# EAGLE design keyboard (EAGLE 8.5.2)
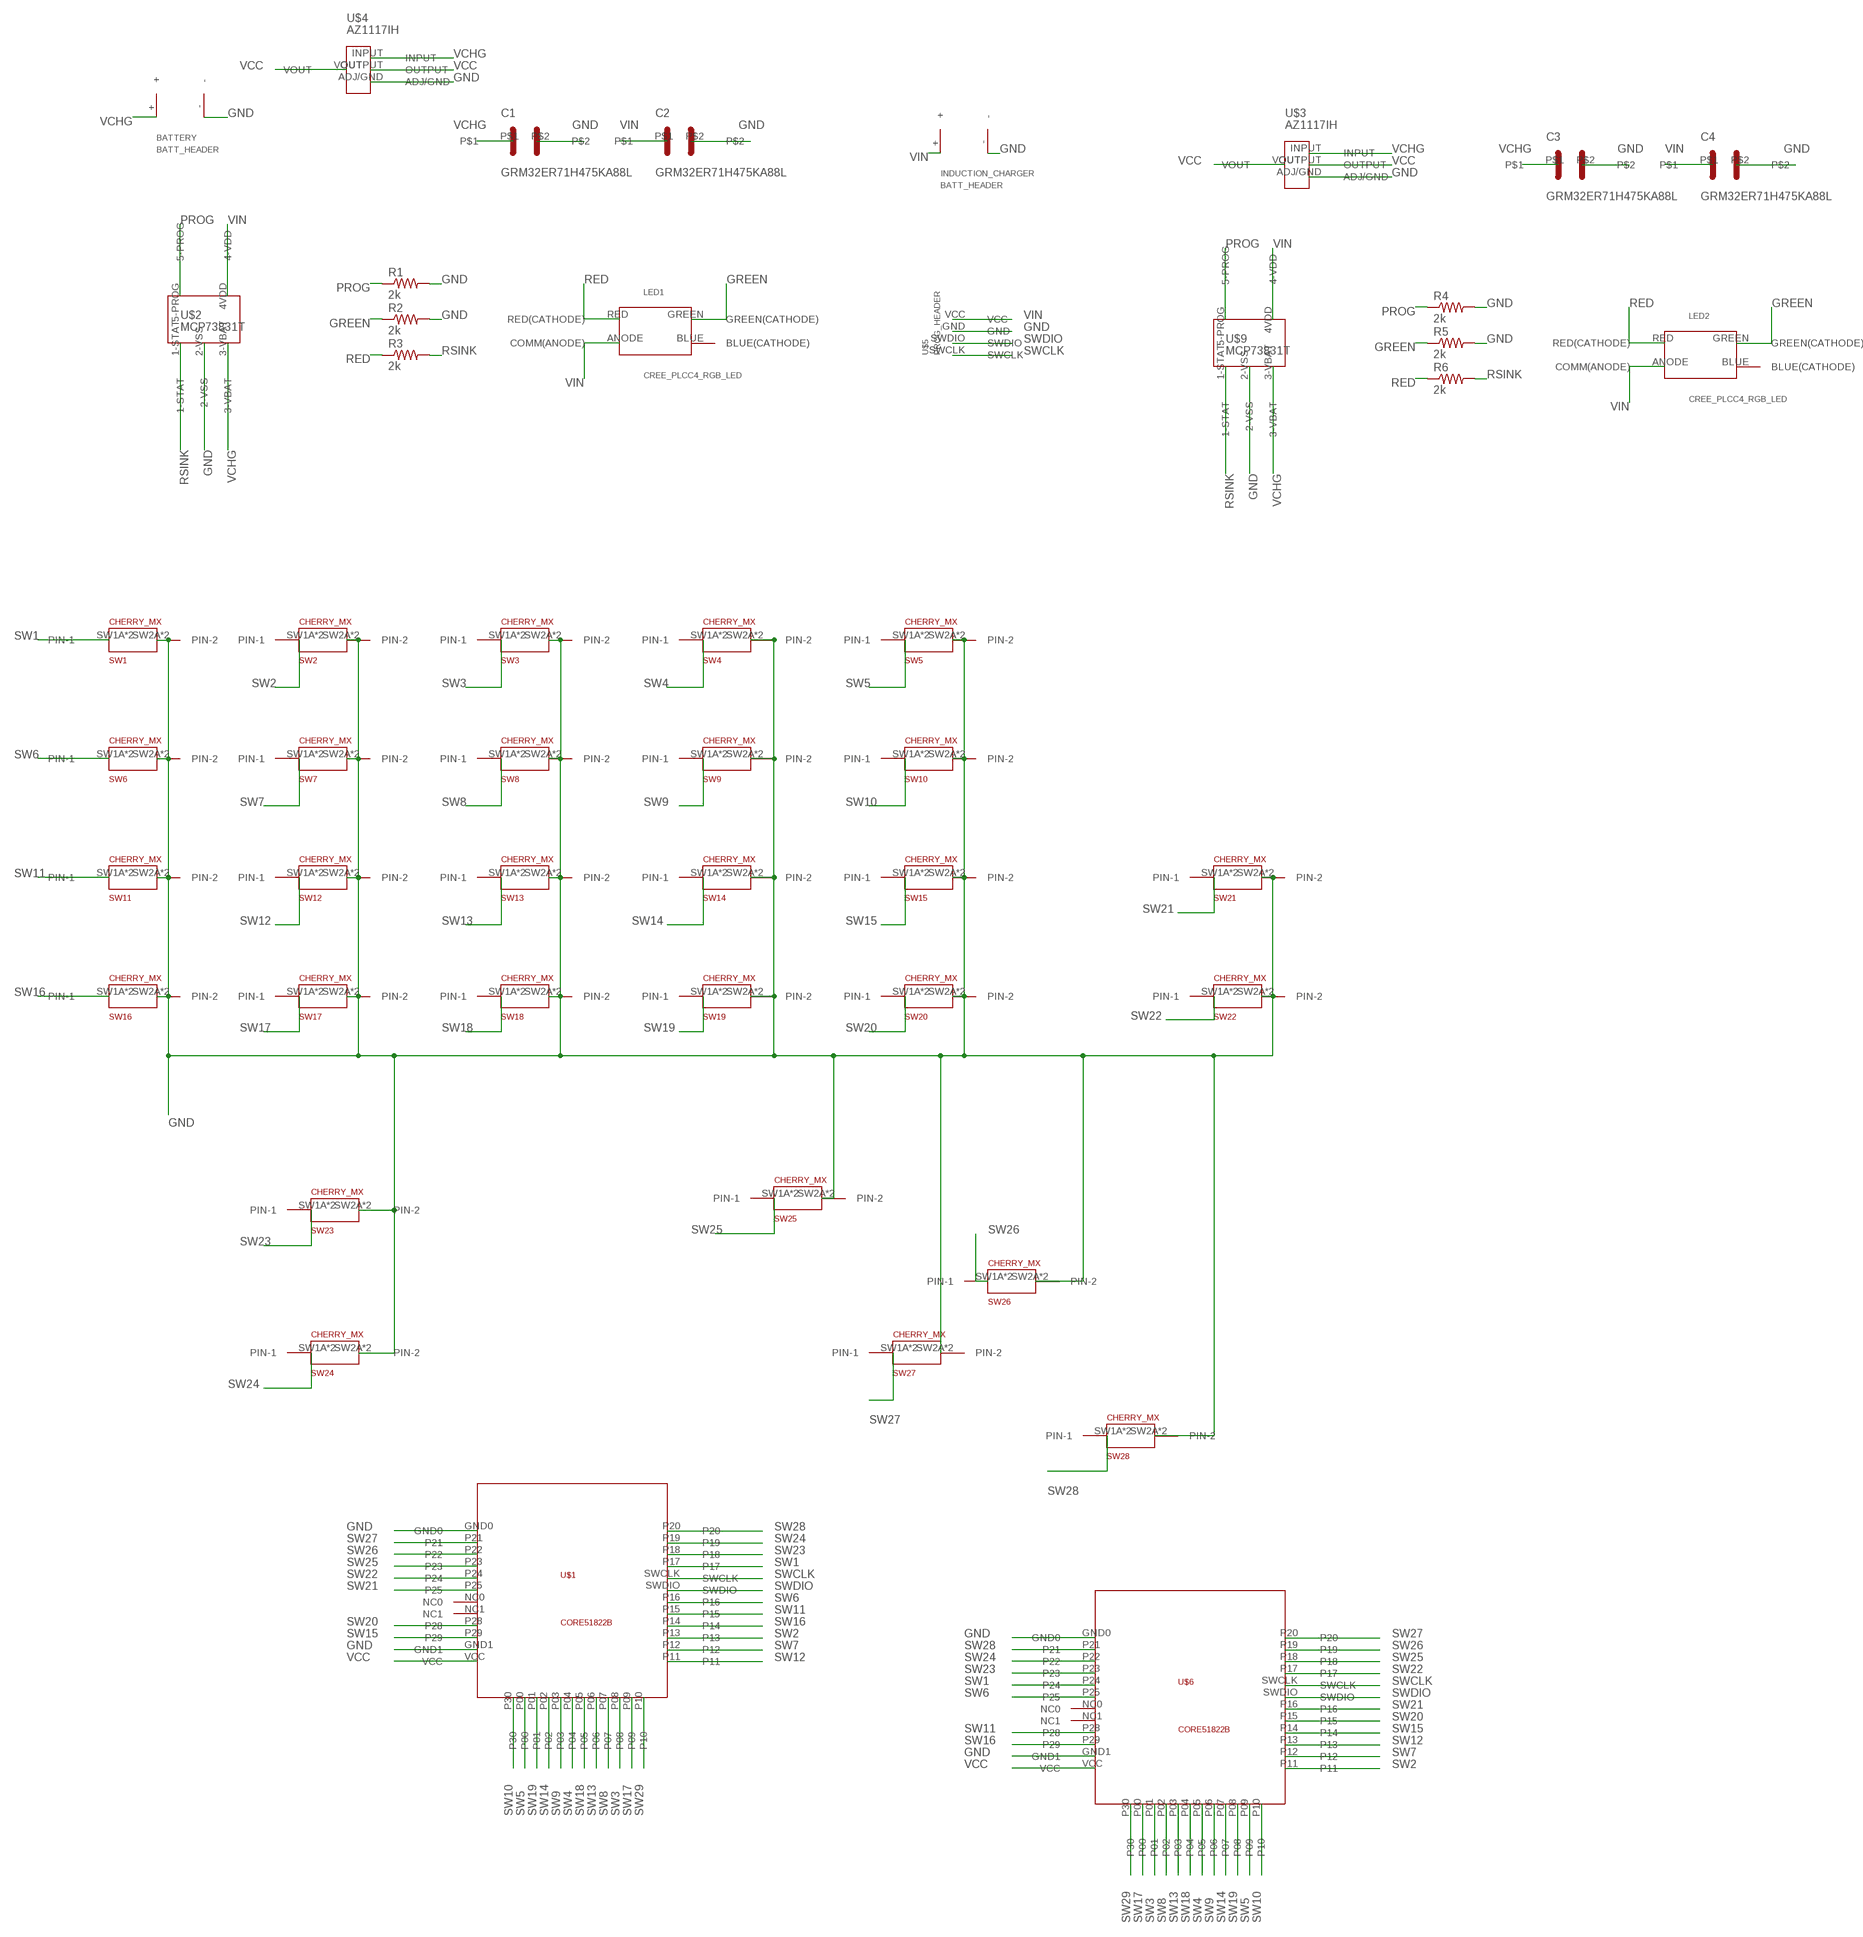
[diagram p0: schematic, sheet 1]

## Parts
BATTERY  BATT_HEADER  [BATT_HEADER]
C1  GRM32ER71H475KA88L  [GRM32ER71H475KA88L]
C2  GRM32ER71H475KA88L  [GRM32ER71H475KA88L]
C3  GRM32ER71H475KA88L  [GRM32ER71H475KA88L]
C4  GRM32ER71H475KA88L  [GRM32ER71H475KA88L]
INDUCTION_CHARGER  BATT_HEADER  [BATT_HEADER]
LED1  CREE_PLCC4_RGB_LED  [4-PLCC]
LED2  CREE_PLCC4_RGB_LED  [4-PLCC]
R1  2k  R-US_R1210  [R1210]
R2  2k  R-US_R1210  [R1210]
R3  2k  R-US_R1210  [R1210]
R4  2k  R-US_R1210  [R1210]
R5  2k  R-US_R1210  [R1210]
R6  2k  R-US_R1210  [R1210]
SW1  CHERRY_MX  [CHERRY_MX]
SW2  CHERRY_MX  [CHERRY_MX]
SW3  CHERRY_MX  [CHERRY_MX]
SW4  CHERRY_MX  [CHERRY_MX]
SW5  CHERRY_MX  [CHERRY_MX]
SW6  CHERRY_MX  [CHERRY_MX]
SW7  CHERRY_MX  [CHERRY_MX]
SW8  CHERRY_MX  [CHERRY_MX]
SW9  CHERRY_MX  [CHERRY_MX]
SW10  CHERRY_MX  [CHERRY_MX]
SW11  CHERRY_MX  [CHERRY_MX]
SW12  CHERRY_MX  [CHERRY_MX]
SW13  CHERRY_MX  [CHERRY_MX]
SW14  CHERRY_MX  [CHERRY_MX]
SW15  CHERRY_MX  [CHERRY_MX]
SW16  CHERRY_MX  [CHERRY_MX]
SW17  CHERRY_MX  [CHERRY_MX]
SW18  CHERRY_MX  [CHERRY_MX]
SW19  CHERRY_MX  [CHERRY_MX]
SW20  CHERRY_MX  [CHERRY_MX]
SW21  CHERRY_MX  [CHERRY_MX]
SW22  CHERRY_MX  [CHERRY_MX]
SW23  CHERRY_MX  [CHERRY_MX]
SW24  CHERRY_MX  [CHERRY_MX]
SW25  CHERRY_MX  [CHERRY_MX]
SW26  CHERRY_MX  [CHERRY_MX]
SW27  CHERRY_MX  [CHERRY_MX]
SW28  CHERRY_MX  [CHERRY_MX]
U$1  CORE51822B  [CORE51822B]
U$2  MCP73831T  [MCP73831T]
U$3  AZ1117IH  [AZ1117IH]
U$4  AZ1117IH  [AZ1117IH]
U$5  PROG_HEADER  [PROG_HEADER]
U$6  CORE51822B  [CORE51822B]
U$9  MCP73831T  [MCP73831T]

## Nets
GND: BATTERY.- C1.P$2 C2.P$2 C3.P$2 C4.P$2 INDUCTION_CHARGER.- R1.2 R2.2 R4.2 R5.2 SW1.SW2A(PIN-2) SW1.SW2B(PIN-2) SW2.SW2A(PIN-2) SW2.SW2B(PIN-2) SW3.SW2A(PIN-2) SW3.SW2B(PIN-2) SW4.SW2A(PIN-2) SW4.SW2B(PIN-2) SW5.SW2A(PIN-2) SW5.SW2B(PIN-2) SW6.SW2A(PIN-2) SW6.SW2B(PIN-2) SW7.SW2A(PIN-2) SW7.SW2B(PIN-2) SW8.SW2A(PIN-2) SW8.SW2B(PIN-2) SW9.SW2A(PIN-2) SW9.SW2B(PIN-2) SW10.SW2A(PIN-2) SW10.SW2B(PIN-2) SW11.SW2A(PIN-2) SW11.SW2B(PIN-2) SW12.SW2A(PIN-2) SW12.SW2B(PIN-2) SW13.SW2A(PIN-2) SW13.SW2B(PIN-2) SW14.SW2A(PIN-2) SW14.SW2B(PIN-2) SW15.SW2A(PIN-2) SW15.SW2B(PIN-2) SW16.SW2A(PIN-2) SW16.SW2B(PIN-2) SW17.SW2A(PIN-2) SW17.SW2B(PIN-2) SW18.SW2A(PIN-2) SW18.SW2B(PIN-2) SW19.SW2A(PIN-2) SW19.SW2B(PIN-2) SW20.SW2A(PIN-2) SW20.SW2B(PIN-2) SW21.SW2A(PIN-2) SW21.SW2B(PIN-2) SW22.SW2A(PIN-2) SW22.SW2B(PIN-2) SW23.SW2A(PIN-2) SW23.SW2B(PIN-2) SW24.SW2A(PIN-2) SW24.SW2B(PIN-2) SW25.SW2A(PIN-2) SW25.SW2B(PIN-2) SW26.SW2A(PIN-2) SW26.SW2B(PIN-2) SW27.SW2A(PIN-2) SW27.SW2B(PIN-2) SW28.SW2A(PIN-2) SW28.SW2B(PIN-2) U$1.GND0 U$1.GND1 U$2.2-VSS U$3.ADJ/GND U$4.ADJ/GND U$5.GND U$6.GND0 U$6.GND1 U$9.2-VSS
GREEN: LED1.GREEN(GREEN(CATHODE)) LED2.GREEN(GREEN(CATHODE)) R2.1 R5.1
PROG: R1.1 R4.1 U$2.5-PROG U$9.5-PROG
RED: LED1.RED(RED(CATHODE)) LED2.RED(RED(CATHODE)) R3.1 R6.1
RSINK: R3.2 R6.2 U$2.1-STAT U$9.1-STAT
SW1: SW1.SW1A(PIN-1) SW1.SW1B(PIN-1) U$1.P17 U$6.P24
SW2: SW2.SW1A(PIN-1) SW2.SW1B(PIN-1) U$1.P13 U$6.P11
SW3: SW3.SW1A(PIN-1) SW3.SW1B(PIN-1) U$1.P08 U$6.P01
SW4: SW4.SW1A(PIN-1) SW4.SW1B(PIN-1) U$1.P04 U$6.P05
SW5: SW5.SW1A(PIN-1) SW5.SW1B(PIN-1) U$1.P00 U$6.P09
SW6: SW6.SW1A(PIN-1) SW6.SW1B(PIN-1) U$1.P16 U$6.P25
SW7: SW7.SW1A(PIN-1) SW7.SW1B(PIN-1) U$1.P12 U$6.P12
SW8: SW8.SW1A(PIN-1) SW8.SW1B(PIN-1) U$1.P07 U$6.P02
SW9: SW9.SW1A(PIN-1) SW9.SW1B(PIN-1) U$1.P03 U$6.P06
SW10: SW10.SW1A(PIN-1) SW10.SW1B(PIN-1) U$1.P30 U$6.P10
SW11: SW11.SW1A(PIN-1) SW11.SW1B(PIN-1) U$1.P15 U$6.P28
SW12: SW12.SW1A(PIN-1) SW12.SW1B(PIN-1) U$1.P11 U$6.P13
SW13: SW13.SW1A(PIN-1) SW13.SW1B(PIN-1) U$1.P06 U$6.P03
SW14: SW14.SW1A(PIN-1) SW14.SW1B(PIN-1) U$1.P02 U$6.P07
SW15: SW15.SW1A(PIN-1) SW15.SW1B(PIN-1) U$1.P29 U$6.P14
SW16: SW16.SW1A(PIN-1) SW16.SW1B(PIN-1) U$1.P14 U$6.P29
SW17: SW17.SW1A(PIN-1) SW17.SW1B(PIN-1) U$1.P09 U$6.P00
SW18: SW18.SW1A(PIN-1) SW18.SW1B(PIN-1) U$1.P05 U$6.P04
SW19: SW19.SW1A(PIN-1) SW19.SW1B(PIN-1) U$1.P01 U$6.P08
SW20: SW20.SW1A(PIN-1) SW20.SW1B(PIN-1) U$1.P28 U$6.P15
SW21: SW21.SW1A(PIN-1) SW21.SW1B(PIN-1) U$1.P25 U$6.P16
SW22: SW22.SW1A(PIN-1) SW22.SW1B(PIN-1) U$1.P24 U$6.P17
SW23: SW23.SW1A(PIN-1) SW23.SW1B(PIN-1) U$1.P18 U$6.P23
SW24: SW24.SW1A(PIN-1) SW24.SW1B(PIN-1) U$1.P19 U$6.P22
SW25: SW25.SW1A(PIN-1) SW25.SW1B(PIN-1) U$1.P23 U$6.P18
SW26: SW26.SW1A(PIN-1) SW26.SW1B(PIN-1) U$1.P22 U$6.P19
SW27: SW27.SW1A(PIN-1) SW27.SW1B(PIN-1) U$1.P21 U$6.P20
SW28: SW28.SW1A(PIN-1) SW28.SW1B(PIN-1) U$1.P20 U$6.P21
SW29: U$1.P10 U$6.P30
SWCLK: U$1.SWCLK U$5.SWCLK U$6.SWCLK
SWDIO: U$1.SWDIO U$5.SWDIO U$6.SWDIO
VCC: U$1.VCC U$3.OUTPUT U$3.VOUT U$4.OUTPUT U$4.VOUT U$6.VCC
VCHG: BATTERY.+ C1.P$1 C3.P$1 U$2.3-VBAT U$3.INPUT U$4.INPUT U$9.3-VBAT
VIN: C2.P$1 C4.P$1 INDUCTION_CHARGER.+ LED1.ANODE(COMM(ANODE)) LED2.ANODE(COMM(ANODE)) U$2.4VDD(4-VDD) U$5.VCC U$9.4VDD(4-VDD)
Unconnected: LED1.BLUE(BLUE(CATHODE)) LED2.BLUE(BLUE(CATHODE)) U$1.NC0 U$1.NC1 U$6.NC0 U$6.NC1

## Library data of the parts
BATTERY INDUCTION_CHARGER = batt_header:BATT_HEADER
C1-C4 = GRM32ER71H475KA88L:GRM32ER71H475KA88L
LED1 LED2 = cree_plcc4_rgb_led:CREE_PLCC4_RGB_LED: Cree®PLCC4 3 in 1 SMD LED CLVBA-FKA
R1-R6 = resistor:R-US_: RESISTOR, American symbol
SW1-SW28 = cherry_mx:CHERRY_MX
U$1 U$6 = core51822b:CORE51822B: Core51822-b nRF51822 PCB
U$2 U$9 = mcp73831t:MCP73831T
U$3 U$4 = az1117ih:AZ1117IH
U$5 = prog_header:PROG_HEADER

## Board
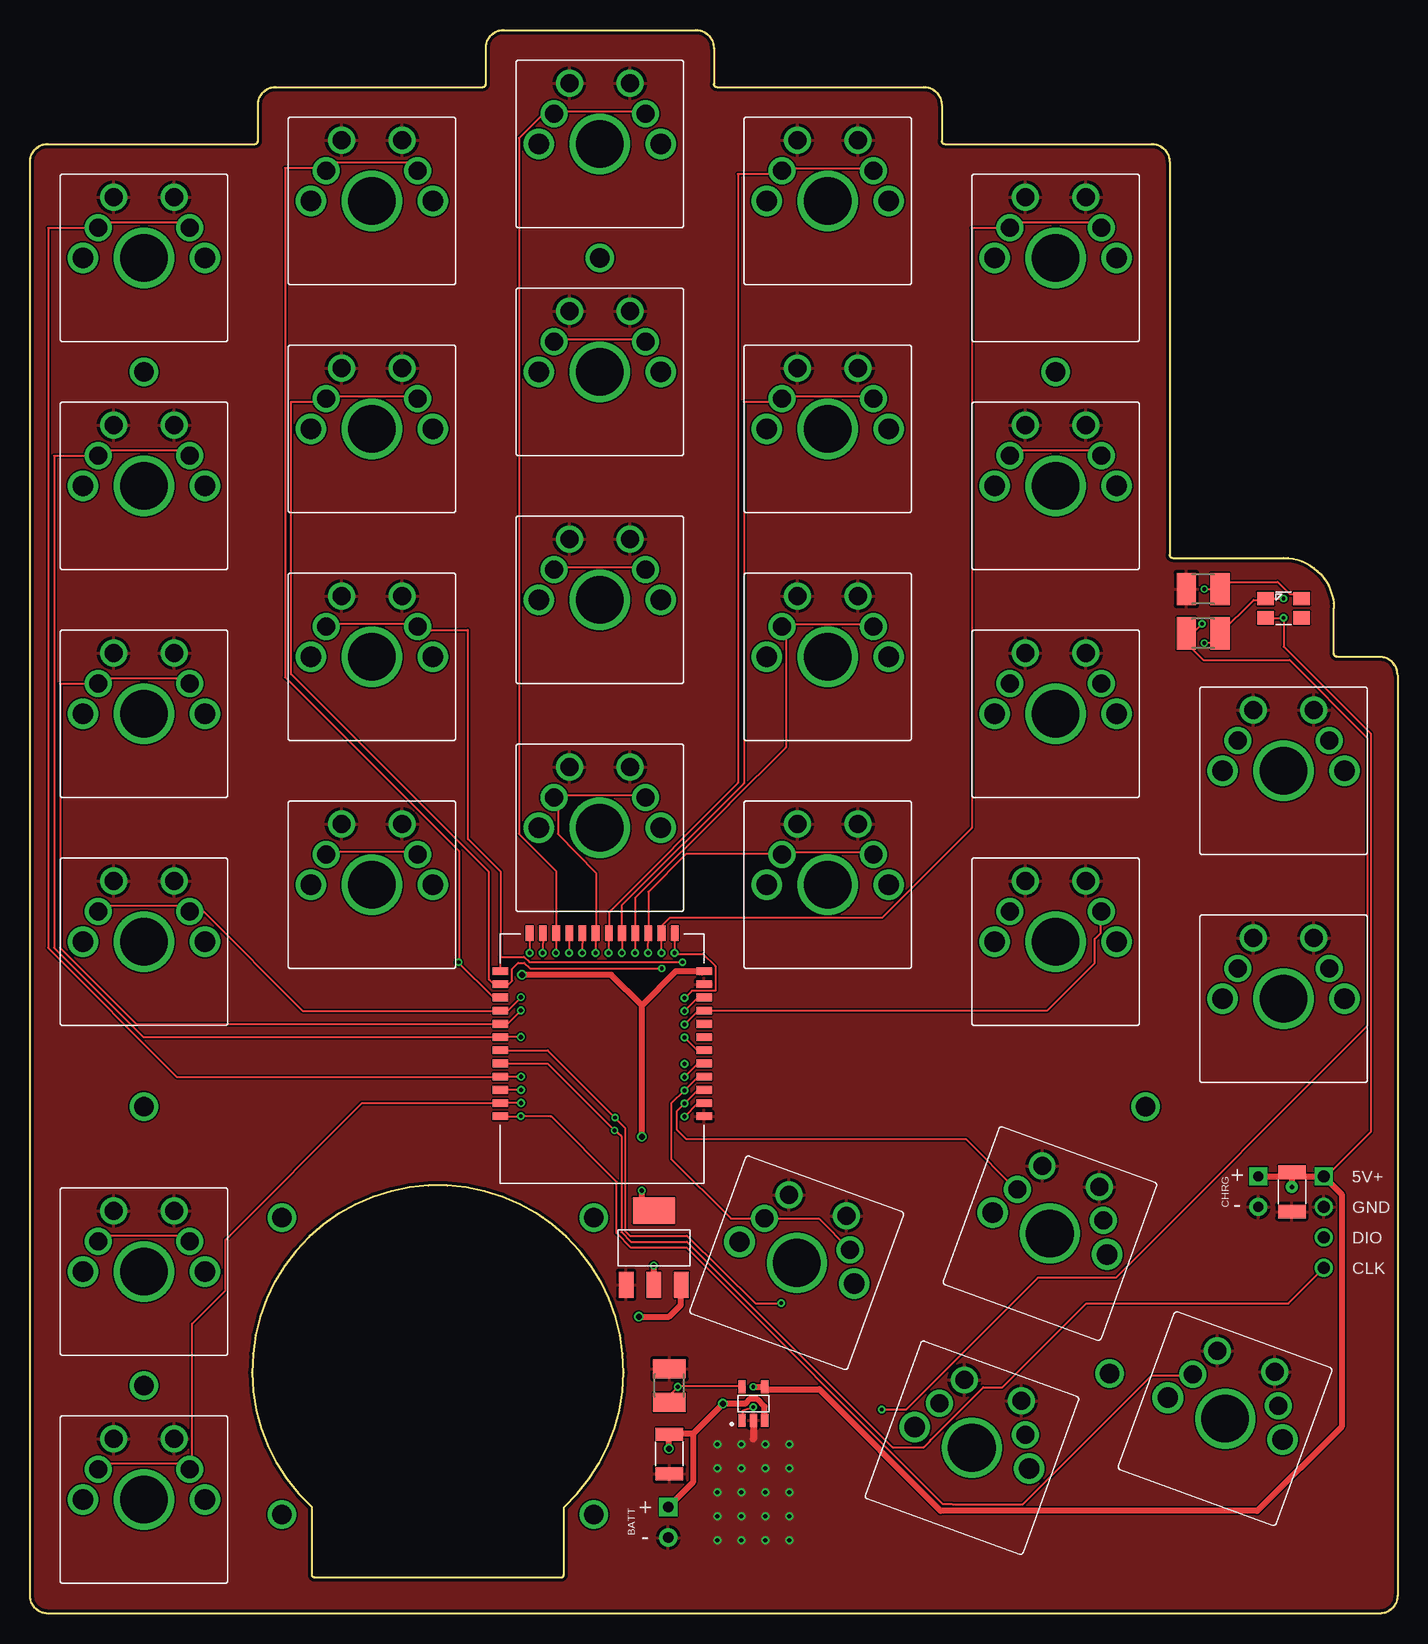
[diagram p1: board, top side]
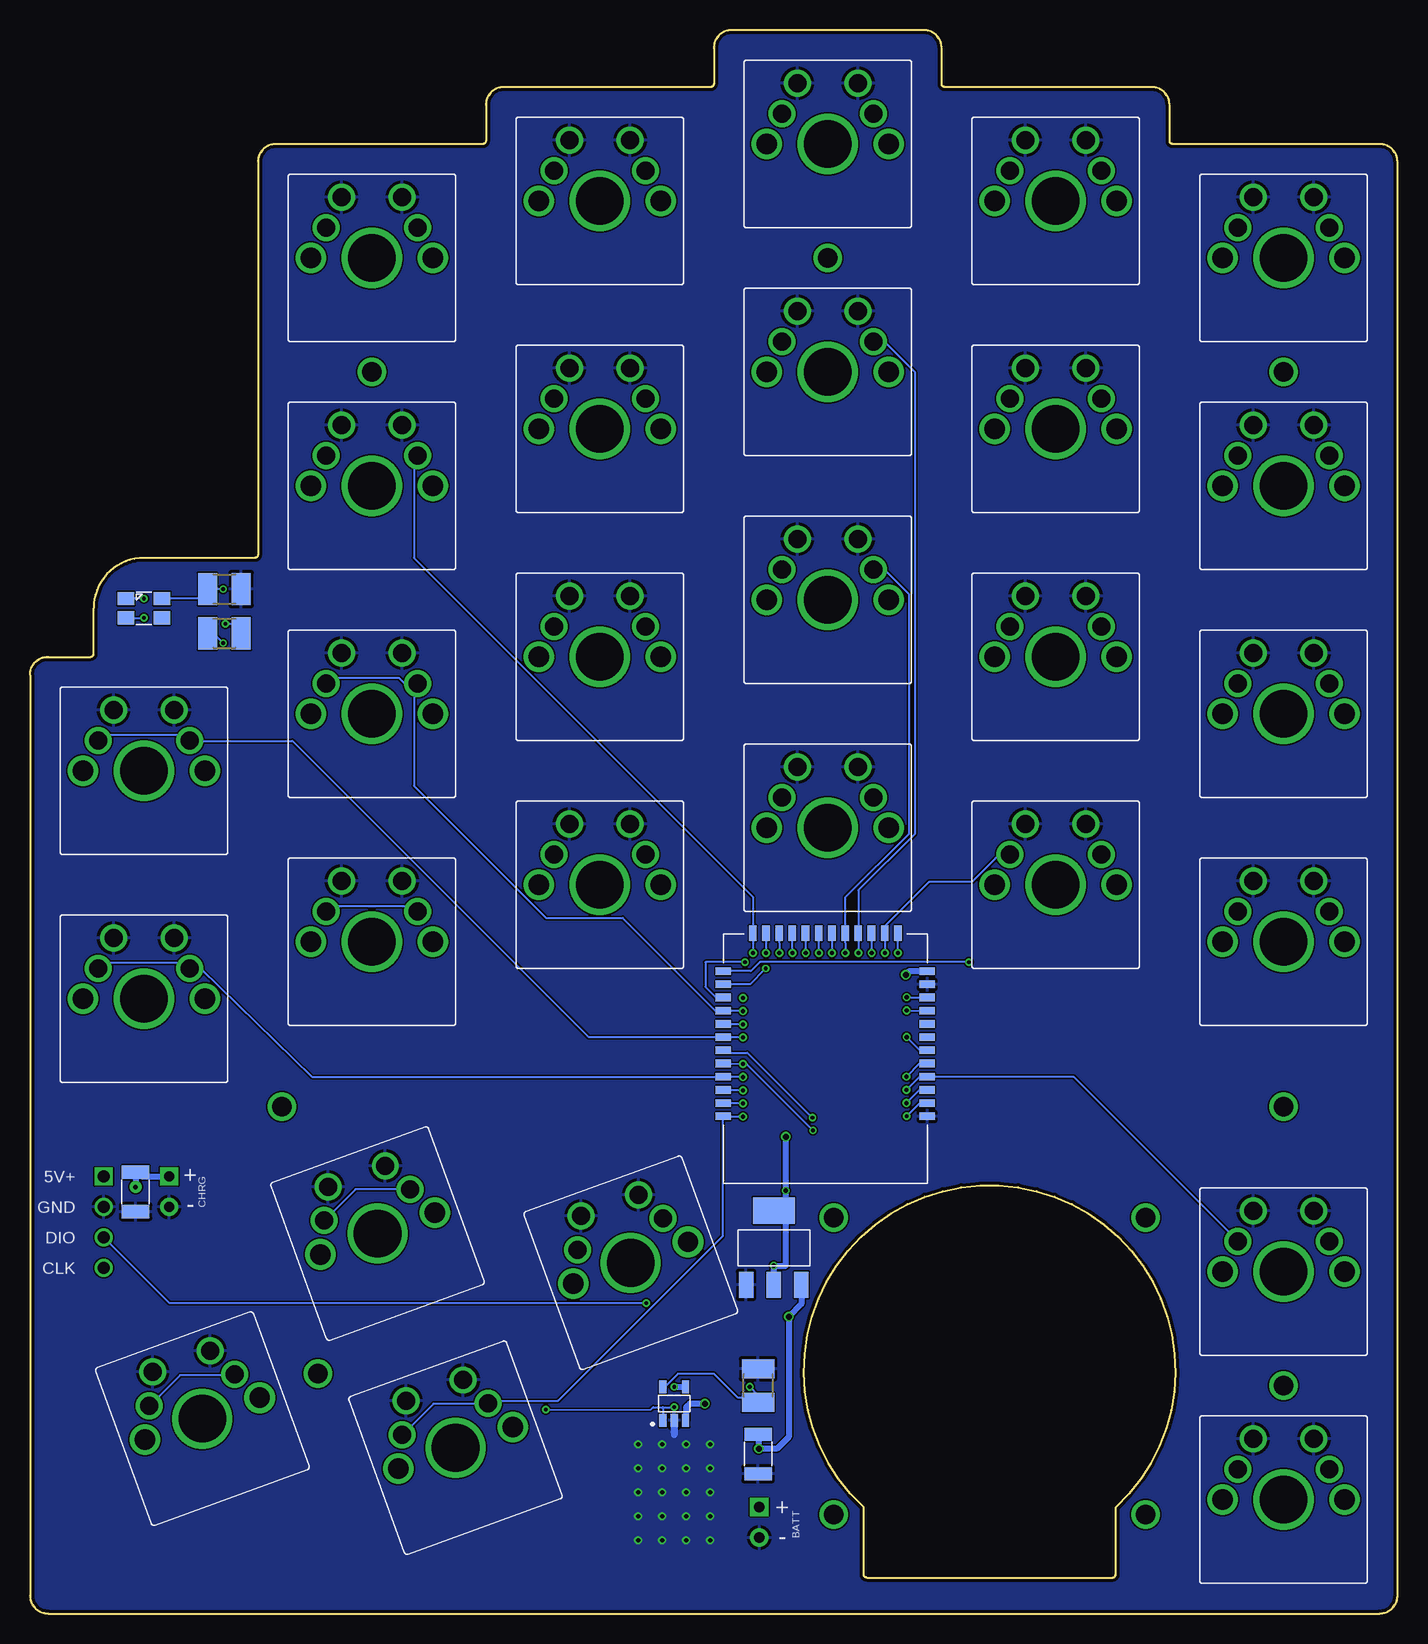
[diagram p2: board, bottom side, seen from below]

Size 114 x 132 mm. Coordinates in mm from the lower left corner, seen from the top.
Outline: 76,125.75 76,122.75 arc90 76.25,122.5 93.5,122.5 arc-90 95,121 95,88.25 arc90 95.25,88 104.5,88 arc-90 108.7,83.8 108.7,80 arc90 108.95,79.75 112.5,79.75 arc-90 114,78.25 114,1.5 arc-90 112.5,0 1.5,0 arc-90 0,1.5 0,121 arc-90 1.5,122.5 18.75,122.5 arc90 19,122.75 19,125.75 arc-90 20.5,127.25 37.75,127.25 arc90 38,127.5 38,130.5 arc-90 39.5,132 55.5,132 arc-90 57,130.5 57,127.5 arc90 57.25,127.25 74.5,127.25 arc-90 76,125.75
Outline: 44.25,3 23.75,3 arc-90 23.5,3.25 23.5,8.85 arc-275 44.5,8.85 44.5,3.25 arc-90 44.25,3
Copper layers (1*16): Top 0.035mm / dielectric 1.5mm / Bottom 0.035mm
Design rules "dirt_cheap_dirty_boards.v1": minimum track width 5mil, minimum drill 12mil, track to track 5mil, track to pad 5mil, pad to pad 5mil, via to via 5mil, smd to smd 0mil, copper to edge 10mil, drill to drill 10mil, minimum pad ring 10mil, minimum via ring 6mil, stop-mask expansion 2mil, vias tented up to drill 25mil, thermal gap 10mil

### Footprints (pad centres in the part's own frame; a part is rotated, then mirrored left to right if it is on the bottom)
BATT_HEADER = drill 0.85 pad 1.524 square: + -1.27,0 | drill 0.85 pad 1.524: - 1.27,0
GRM32ER71H475KA88L = smd 1.1 x 2.3: P$1 -1.65,0; P$2 1.65,0
4-PLCC = smd 1.4 x 1.1: ANODE -1.5,-0.8; BLUE 1.5,-0.8; GREEN 1.5,0.8; RED -1.5,0.8
R1210 = smd 1.6 x 2.7: 1 -1.4,0; 2 1.4,0
CHERRY_MX = drill 1.702 pad 1.93: P$1 -5.08,0; P$2 5.08,0 | drill 3.988 pad 4.572: P$3 0,0 | drill 1.499: SW1A 3.81,2.54; SW1B -3.81,2.54; SW2A -2.54,5.08; SW2B 2.54,5.08
CORE51822B = smd 1.27 x 0.635: GND0 -8.5,4.8; GND1 -8.5,-6.2; NC0 -8.5,-1.8; NC1 -8.5,-2.9; P11 8.5,-7.3; P12 8.5,-6.2; P13 8.5,-5.1; P14 8.5,-4; P15 8.5,-2.9; P16 8.5,-1.8; P17 8.5,1.5; P18 8.5,2.6; P19 8.5,3.7; P20 8.5,4.8; P21 -8.5,3.7; P22 -8.5,2.6; P23 -8.5,1.5; P24 -8.5,0.4; P25 -8.5,-0.7; P28 -8.5,-4; P29 -8.5,-5.1; SWCLK 8.5,0.4; SWDIO 8.5,-0.7; VCC -8.5,-7.3 | smd 0.635 x 1.27: P00 -4.95,-10.45; P01 -3.85,-10.45; P02 -2.75,-10.45; P03 -1.65,-10.45; P04 -0.55,-10.45; P05 0.55,-10.45; P06 1.65,-10.45; P07 2.75,-10.45; P08 3.85,-10.45; P09 4.95,-10.45; P10 6.05,-10.45; P30 -6.05,-10.45
MCP73831T = smd 0.6 x 1.1: 1-STAT -0.95,-1.4; 2-VSS 0,-1.4; 3-VBAT 0.95,-1.4; 4VDD 0.95,1.4; 5-PROG -0.95,1.4
AZ1117IH = smd 1.2 x 2.2: ADJ/GND -2.3,-3.1; INPUT 2.3,-3.1; OUTPUT 0,-3.1 | smd 3.5 x 2.2: VOUT 0,3.1
PROG_HEADER = drill 1: GND 0,-2.54; SWCLK 0,-7.62; SWDIO 0,-5.08 | drill 1 square: VCC 0,0

### Placement (x,y rotation side)
BATTERY  53.2,7.6 270 top
C1  53.3,13.3 270 top
C2  105.2,35.15 270 top
C3  53.3,13.3 270 bottom
C4  105.2,35.15 270 bottom
INDUCTION_CHARGER  102.4,35.16 270 top
LED1  104.5,83.8 0 top
LED2  104.5,83.8 0 bottom
R1  53.3,19 90 top
R2  97.8,85.4 180 top
R3  97.8,81.7 180 top
R4  53.3,19 90 bottom
R5  97.8,85.4 0 bottom
R6  97.8,81.7 0 bottom
SW1  9.5,113 0 top
SW2  28.5,117.75 0 top
SW3  47.5,122.5 0 top
SW4  66.5,117.75 0 top
SW5  85.5,113 0 top
SW6  9.5,94 0 top
SW7  28.5,98.75 0 top
SW8  47.5,103.5 0 top
SW9  66.5,98.75 0 top
SW10  85.5,94 0 top
SW11  9.5,75 0 top
SW12  28.5,79.75 0 top
SW13  47.5,84.5 0 top
SW14  66.5,79.75 0 top
SW15  85.5,75 0 top
SW16  9.5,56 0 top
SW17  28.5,60.75 0 top
SW18  47.5,65.5 0 top
SW19  66.5,60.75 0 top
SW20  85.5,56 0 top
SW21  104.5,70.25 0 top
SW22  104.5,51.25 0 top
SW23  9.5,28.5 0 top
SW24  9.5,9.5 0 top
SW25  63.92,29.24 340 top
SW26  85.03,31.67 340 top
SW27  78.53,13.82 340 top
SW28  99.63,16.25 340 top
U$1  47.7,46.25 180 top
U$2  60.3,17.5 0 top
U$3  52,30.5 0 top
U$4  52,30.5 0 bottom
U$5  107.86,36.43 0 top
U$6  47.7,46.25 180 bottom
U$9  60.3,17.5 0 bottom

### Tracks (layer width: path | path; a pad name or v marks a point on that pad's centre or on a via)
GND  (via drill 0.35)
  Top 0.508: U$9.2-VSS 60.3,16.01
  Top 0.6: 60.3,16.01 60.3,14.54
  Bottom 0.508: U$9.2-VSS 60.3,15.68 | 60.3,15.08 60.27,14.87
  Bottom 0.6: 60.3,15.68 60.3,15.08
  other vias: 57.3,14.1 59.3,14.1 61.3,14.1 63.3,14.1 57.3,12.1 59.3,12.1 61.3,12.1 63.3,12.1 57.3,10.1 59.3,10.1 61.3,10.1 63.3,10.1 57.3,8.1 59.3,8.1 61.3,8.1 63.3,8.1 57.3,6.1 59.3,6.1 61.3,6.1 63.3,6.1
  pour Bottom: -4.5,133 118.5,133 119.5,132 119.5,-4 -4.5,-4 -5.5,-3 -5.5,132
  pour Top: -22.5,137 -22.5,-17 125.5,-17 128.5,-14 128.5,136 127.5,137
GREEN  (via drill 0.3)
  Top 0.152: v97.9,85.4 R5.1 100,86 104,86 105,85 106,85 LED1.GREEN
  Bottom 0.152: v97.9,85.4 R5.1 99.9,84.6 LED2.GREEN
N$1  (via drill 1.59)
  other vias: 9.5,42.25
N$2  (via drill 1.59)
  other vias: 93,42.25
N$3  (via drill 1.59)
  other vias: 9.5,103.5
N$4  (via drill 1.59)
  other vias: 85.5,103.5
N$5  (via drill 1.59)
  other vias: 47.5,113
N$6  (via drill 1.59)
  other vias: 9.5,19
N$7  (via drill 1.59)
  other vias: 90,20
N$8  (via drill 1.59)
  other vias: 21,33
N$9  (via drill 1.59)
  other vias: 21,8.25
N$10  (via drill 1.59)
  other vias: 47,8.25
N$11  (via drill 1.59)
  other vias: 47,33
PROG  (via drill 0.35)
  Top 0.152: R4.1 53.3,18.2 v54,18.9 54,19 59.5,19 U$2.5-PROG
  Bottom 0.152: v54,18.9 53.3,18.2 R4.1 53.5,18 55,18 57,20 60,20 61,19 U$9.5-PROG
RED  (via drill 0.3)
  Top 0.152: v104.5,84.6 LED1.RED 103,84.5 102,84.5 R6.1 98.4,80.9 v97.9,80.9
  Bottom 0.152: v104.5,84.6 LED2.RED | v97.9,80.9 98.7,81.7 R6.1
RSINK  (via drill 0.3)
  Top 0.152: v97.7,82.5 96.9,81.7 R6.2 96.4,80.9 97.8,79.5 105,79.5 111.47,73 111.47,48.98 90.5,28 84,28 73,17 v71,17 | v60.3,17.2 59.38,16.89 59.37,16.45 U$2.1-STAT
  Bottom 0.152: R6.2 97.2,82.5 v97.7,82.5 | 61.25,17.2 v60.3,17.2 | 61.25,17.2 U$9.1-STAT | v71,17 62.25,17 62.05,17.2 61.25,17.2
SW1  (via drill 0.35)
  Top 0.152: v40.95,44.75 U$1.P17 12.22,44.75 1.5,55.5 1.5,115.5 5.5,115.5 SW1.SW1B 6,116 13,116 SW1.SW1A
  Bottom 0.152: v40.95,44.75 39.85,45.85 U$6.P24 39.2,45.75
SW2  (via drill 0.3)
  Top 0.152: U$1.P13 39.2,51.25 38.65,51.35 35.65,54.33 35.67,54.35 v35.73,54.3 35.75,54.38 35.75,63.55 21.25,78.05 21.25,120.5 25,120.5 SW2.SW1B 25.5,121 32.5,121 SW2.SW1A
  Bottom 0.152: U$6.P11 53.9,53.55 53.15,54.3 v35.73,54.3
SW3  (via drill 0.35)
  Top 0.152: U$6.P01 v43.84,55.05 | U$6.P01 43.85,61.9 40.75,65 40.75,123 42.75,125 43.5,125 SW3.SW1B 43.75,125.25 51.25,125.25 SW3.SW1A | 43.85,56.65 U$6.P01
  Bottom 0.152: U$6.P01 v43.84,55.05
SW4  (via drill 0.35)
  Top 0.152: U$6.P05 48.23,56.69 v48.23,55.05 | 48.2,56.75 U$6.P05 | SW4.SW1A 70,120.5 63,120.5 SW4.SW1B 62.5,120 59,120 59,69.25 48.25,58.45 U$6.P05
  Bottom 0.152: v48.23,55.05 U$6.P05
SW5  (via drill 0.35)
  Top 0.152: v52.63,55.05 U$6.P09 | 52.7,56.75 U$6.P09 | SW5.SW1A 89,116 82,116 SW5.SW1B 81.5,115.5 78.5,115.5 78.5,65.5 71,58 53.33,58 52.6,57.27 52.75,56.75 U$6.P09
  Bottom 0.152: U$6.P09 v52.63,55.05
SW6  (via drill 0.35)
  Top 0.152: v40.92,48.05 U$1.P16 | 39.2,48.25 U$1.P16 | SW6.SW1A 13,97 6,97 SW6.SW1B 5.5,96.5 2,96.5 2,55.5 9.45,48.05 U$1.P16
  Bottom 0.152: v40.92,48.05 39.85,47 39.8,46.95 U$6.P25
SW7  (via drill 0.3)
  Top 0.152: v52.67,53.77 41.67,53.77 41.2,54.25 40.7,54.25 40.2,53.75 40.2,52.75 39.9,52.45 U$1.P12 38.65,52.48 38.25,52.85 38.25,61.8 21.75,78.3 21.75,101 24.5,101 SW7.SW1B 25,101.5 32,101.5 SW7.SW1A
  Bottom 0.152: U$6.P12 54,52.45 v52.67,53.77
SW8  (via drill 0.35)
  Top 0.152: v44.94,55.05 U$6.P02 45.2,56.75 | SW8.SW1A 51.25,106.25 43.75,106.25 SW8.SW1B
  Bottom 0.152: U$6.P02 v44.94,55.05 | U$6.P02 44.95,60.3 40.25,65 40.25,103.5 42.75,106 43.5,106 SW8.SW1B | 44.95,56.55 U$6.P02
SW9  (via drill 0.35)
  Top 0.152: U$6.P06 49.34,56.69 v49.34,55.05 | 49.2,56.75 U$6.P06 | SW9.SW1A 70,101.5 63,101.5 SW9.SW1B 62.5,101 59.5,101 59.5,69.2 49.33,59.02 49.33,56.52 U$6.P06
  Bottom 0.152: U$6.P06 v49.34,55.05
SW10  (via drill 0.35)
  Top 0.152: U$6.P10 53.73,56.69 v53.73,55.05 53.75,55 56.1,55 57.12,53.98 57.12,51.9 55.17,51.9 54.67,51.4 54.62,51.38 v54.56,51.31 | SW10.SW1A 89,97 82,97 SW10.SW1B
  Bottom 0.152: v54.56,51.31 54.59,51.35 | v53.73,55.05 U$6.P10 53.75,59.75 82,88 82,96.25 81.75,96.5 SW10.SW1B
SW11  (via drill 0.35)
  Top 0.152: v40.92,50.27 39.8,49.15 U$1.P15 | 39.2,49.25 U$1.P15 | SW11.SW1A 13,78 6,78 SW11.SW1B 5.5,77.5 2.5,77.5 2.5,55.5 8.85,49.15 U$1.P15
  Bottom 0.152: v40.92,50.27 U$6.P28
SW12  (via drill 0.3)
  Top 0.152: U$1.P11 39.2,54.75 39.25,54.75 | v54.4,54.3 41.62,54.3 41.17,54.75 39.25,54.75 | SW12.SW1B 25,82.5 32,82.5 SW12.SW1A 32.5,82 36.5,82 36.5,64.55 39.25,61.8 39.25,54.75
  Bottom 0.152: v54.4,54.3 57.7,54.3 57.7,52.25 56.7,51.25 56.2,51.25 U$6.P13
SW13  (via drill 0.35)
  Top 0.152: v46.03,55.05 U$6.P03 46.2,56.75 | SW13.SW1A 51.25,87.25 43.75,87.25 SW13.SW1B
  Bottom 0.152: U$6.P03 v46.03,55.05 | U$6.P03 46.05,59.7 40.75,65 40.75,85 42.75,87 43.5,87 SW13.SW1B | 46.05,56.65 U$6.P03
SW14  (via drill 0.35)
  Top 0.152: U$6.P07 50.44,56.69 v50.44,55.05 | 50.7,56.75 U$6.P07 | SW14.SW1A 70,82.5 63,82.5 SW14.SW1B 63,82 63,72.2 58.27,67.47 58.25,67.45 50.45,59.65 U$6.P07 | 50.45,56.5 U$6.P07
  Bottom 0.152: v50.44,55.05 U$6.P07
SW15  (via drill 0.35)
  Top 0.152: v54.56,50.22 55.7,51.35 U$1.P29 | U$1.P29 56.23,51.31 | 56.25,51.25 U$1.P29
  Bottom 0.152: v54.56,50.22 56.16,50.22 U$6.P14 56.85,50.25 64.6,58 71,58 82,69 82,77.25 | 82,77.25 82,77.5 SW15.SW1B 82,77.25 | 82,77.25 82.5,77.25 83.25,78 88.88,78 89.25,77.62 SW15.SW1A
SW16  (via drill 0.35)
  Top 0.152: v40.92,51.37 39.8,50.25 U$1.P14 22.73,50.25 14.5,58.5 13.5,58.5 SW16.SW1A 13,59 6,59 SW16.SW1B
  Bottom 0.152: v40.92,51.37 U$6.P29
SW17  (via drill 0.35)
  Top 0.152: U$6.P00 v42.73,55.05 | SW17.SW1B 25,63.5 32,63.5 SW17.SW1A
  Bottom 0.152: U$6.P00 v42.73,55.05 | 42.7,56.75 U$6.P00 | SW17.SW1A 32.5,63 33.5,63 35.5,61 39.05,61 42.75,57.3 U$6.P00
SW18  (via drill 0.35)
  Top 0.152: U$6.P04 v47.13,55.05 | 47.2,56.75 U$6.P04 | U$6.P04 47.17,56.5 47.17,61.75 44,65 44,67.75 43.75,68 SW18.SW1B 43.75,68.25 51.25,68.25 SW18.SW1A
  Bottom 0.152: U$6.P04 v47.13,55.05
SW19  (via drill 0.35)
  Top 0.152: v51.53,55.05 U$6.P08 | 51.7,56.75 U$6.P08 | SW19.SW1A 70,63.5 63,63.5 SW19.SW1B 62.3,63.3 54.67,63.3 51.55,60.15 U$6.P08
  Bottom 0.152: U$6.P08 v51.53,55.05
SW20  (via drill 0.35)
  Top 0.152: v54.56,49.12 55.7,50.25 U$1.P28 | U$1.P28 56.22,50.27 | U$1.P28 84.75,50.25 88.75,54.25 88.75,56.25 89.25,56.75 89.25,58.5 SW20.SW1A
  Bottom 0.152: v54.56,49.12 56.16,49.12 U$6.P15 | SW20.SW1B 81.75,58.62 82.12,59 88.88,59 89.25,58.62 SW20.SW1A
SW21  (via drill 0.35)
  Top 0.152: v54.56,48.02 55.62,46.95 U$1.P25 | U$1.P25 56.23,46.91 | 56.25,46.75 U$1.P25
  Bottom 0.152: v54.56,48.02 56.16,48.02 U$6.P16 56.25,48.12 56.42,48.05 67.42,48.05 92.12,72.75 100.62,72.75 SW21.SW1B 100.75,72.88 101.12,73.25 107.88,73.25 108.25,72.88 SW21.SW1A
SW22  (via drill 0.35)
  Top 0.152: v54.56,44.72 55.7,45.85 U$1.P24
  Bottom 0.152: v54.56,44.72 56.16,44.72 U$6.P17 90.5,44.75 99.75,53.75 100.5,53.75 SW22.SW1B 100.75,53.88 101.12,54.25 107.88,54.25 108.25,53.88 SW22.SW1A
SW23  (via drill 0.35)
  Top 0.152: v40.95,43.65 39.8,43.65 U$1.P18 | SW23.SW1B 6,31.5 13,31.5 SW23.SW1A
  Bottom 0.152: v40.95,43.65 39.85,44.75 U$6.P23 27,44.75 13.5,31.25 SW23.SW1A 13,31.5
SW24  (via drill 0.35)
  Top 0.152: v40.95,42.55 U$1.P19 27.68,42.55 16.3,31.15 16.3,26.95 13.5,24.15 13.5,12.5 SW24.SW1A 13,12.5 6,12.5 SW24.SW1B
  Bottom 0.152: v40.95,42.55 39.85,43.65 U$6.P22 39.2,43.75
SW25  (via drill 0.35)
  Top 0.152: 56.23,44.72 U$1.P23 55.7,44.75 v54.56,43.62 53.45,42.51 53.45,37.9 58.42,32.93 SW25.SW1B 65.77,32.93 SW25.SW1A
  Bottom 0.152: v54.56,43.62 56.16,43.62 U$6.P18 56.25,43.5
SW26  (via drill 0.35)
  Top 0.152: 56.25,43.5 U$1.P22 55.7,43.65 v54.56,42.52 53.9,41.85 53.9,40.35 54.7,39.55 78,39.55 82.3,35.25 82.25,35.25 SW26.SW1B
  Bottom 0.152: v54.56,42.52 56.16,42.52 U$6.P19 | SW26.SW1A 89.38,32.88 86.88,35.38 82.38,35.38 SW26.SW1B
SW27  (via drill 0.35)
  Top 0.152: v54.56,41.41 55.7,42.55 U$1.P21
  Bottom 0.152: v54.56,41.41 56.16,41.41 U$6.P20 56.25,41.25 56.25,31.5 70,17.75 75.75,17.75 SW27.SW1B 75.88,17.5 80.38,17.5 82.88,15 SW27.SW1A
SW28  (via drill 0.3)
  Top 0.152: U$1.P20 v40.92,41.45 43.38,41.45 43.4,41.42 43.48,41.42 48.9,36 48.88,31.73 50.1,30.5 54.75,30.5 76.12,9.12 76.88,9.12 82.75,9.12 93.5,19.88 96.88,19.88 SW28.SW1B
  Bottom 0.152: v40.92,41.45 39.83,42.55 U$6.P21 | SW28.SW1A 104,17.38 101.5,19.88 97,19.88 SW28.SW1B
SW29  (via drill 0.35)
  Top 0.152: U$6.P30 v41.63,55.05
  Bottom 0.152: v41.63,55.05 U$6.P30
SWCLK  (via drill 0.3, 0.35)
  Top 0.152: 38.7,45.9 39.2,45.75 U$1.SWCLK 43.15,45.85 v48.73,40.27 49.3,39.77 49.3,31.8 50.1,31 54.75,31 55,30.75 71.9,13.88 74.5,13.88 75,14.38 75.1,14.5 79.47,18.88 81.08,18.88 88.05,25.85 104.9,25.85 U$5.SWCLK
  Bottom 0.152: U$6.SWCLK v54.56,45.81 54.7,45.75 54.2,45.75 v48.73,40.27
SWDIO  (via drill 0.3)
  Top 0.152: 38.7,46.98 39.2,46.75 U$1.SWDIO 43.15,46.95 v48.77,41.33 49.6,40.5 49.6,31.9 50,31.5 54.75,31.5 60.48,25.88 v62.62,25.88
  Bottom 0.152: v48.77,41.33 54.2,46.75 56.2,46.75 U$6.SWDIO | v62.62,25.88 102.38,25.88 107.75,31.25 U$5.SWDIO
VCC  (via drill 0.35, 0.5)
  Top 0.152: 56,53.25 U$1.VCC
  Top 0.508: v51,39.75 51,50.7 | 51,50.7 53.85,53.55 U$1.VCC | 51,50.7 48.45,53.25 v41,53.25 | U$4.OUTPUT v52,29 | 51,33.5 51.1,33.6 U$4.VOUT | 52.5,33.5 52.4,33.6 U$4.VOUT | U$4.VOUT 51,34.6 v51,35.25
  Bottom 0.152: 39.5,53.75 U$6.VCC
  Bottom 0.508: v41,53.25 40.7,53.55 U$6.VCC | v51,35.25 51,29 v52,29 U$4.OUTPUT | v51,35.25 v51,39.75 | U$4.VOUT 51,34.6 v51,35.25
VCHG  (via drill 0.5)
  Top 0.508: U$2.3-VBAT 61.24,16.36 61.24,17.23 60.58,17.89 60.02,17.89 59.63,17.5 v57.75,17.5 55.25,15 | 55.25,15 55.25,10.92 BATTERY.+ | v50.75,24.75 53.25,24.75 54.25,25.75 54.25,27.35 U$3.INPUT | 55.25,15 53.35,15 C1.P$1 53.25,14.9 v53.25,13.75
  Bottom 0.152: U$9.3-VBAT 59.5,16
  Bottom 0.508: 53.3,13.8 v53.25,13.75 | U$4.INPUT 49.7,25.8 v50.75,24.75 50.75,14.75 51.75,13.75 v53.25,13.75 | v53.25,13.75 53.25,14.9 C1.P$1 | v57.75,17.5 59,17.5 59.3,17.2 59.3,16.15 U$9.3-VBAT
VIN  (via drill 0.3, 0.35 pad 1)
  Top 0.152: LED1.ANODE v104.5,83 104.5,80.6 111.8,73.3 111.8,40.2 108.1,36.5 U$5.VCC | 61,19 U$2.4VDD 61.45,18.7
  Top 0.508: 104.87,36.43 C4.P$1 v105.2,35.55 | INDUCTION_CHARGER.+ 104.87,36.43 | 104.87,36.43 U$5.VCC 109.35,34.95 109.35,15.57 102.31,8.56 75.92,8.56 65.8,18.7 61.45,18.7 | v60.3,18.9 U$2.4VDD
  Bottom 0.152: LED2.ANODE v104.5,83
  Bottom 0.508: v60.3,18.9 U$9.4VDD | 104.62,36.43 INDUCTION_CHARGER.+ | C4.P$1 v105.2,35.55

### Text on the board
tPlace: + / - | 5V+ / GND / DIO / CLK | + / -
bPlace: + / - | 5V+ / GND / DIO / CLK | + / -
tNames: CHRG | BATT
bNames: CHRG | BATT
tStop: Jesse Martin
bStop: Jesse Martin